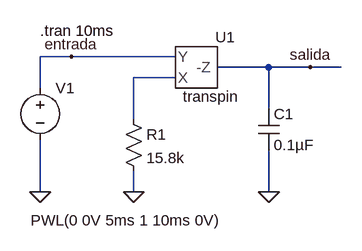
[diagram p0: schematic Integrador inversor.asc]
Integrador inversor.asc, the LTspice schematic file:
Version 4
SHEET 1 880 680
WIRE 96 144 48 144
WIRE 256 144 96 144
WIRE 400 160 320 160
WIRE 464 160 400 160
WIRE 512 160 464 160
WIRE 256 176 192 176
WIRE 48 192 48 144
WIRE 400 224 400 160
WIRE 192 240 192 176
WIRE 48 352 48 272
WIRE 192 352 192 320
WIRE 400 352 400 288
FLAG 48 352 0
FLAG 192 352 0
FLAG 400 352 0
FLAG 464 160 salida
FLAG 96 144 entrada
SYMBOL voltage 48 176 R0
WINDOW 3 -15 220 Left 0
WINDOW 123 0 0 Left 0
WINDOW 39 0 0 Left 0
SYMATTR InstName V1
SYMATTR Value PWL(0 0V 5ms 1 10ms 0V)
SYMBOL transpin 288 96 R0
SYMATTR InstName U1
SYMBOL res 176 224 R0
SYMATTR InstName R1
SYMATTR Value 15.8k
SYMBOL cap 384 224 R0
SYMATTR InstName C1
SYMATTR Value 0.1µF
TEXT 48 104 Left 0 !.tran 10ms

The netlist it stands for:
* Integrador inversor.asc
V1 entrada 0 PWL(0 0V 5ms 1 10ms 0V)
XU1 entrada N001 salida transpin  ; pins Y X Z
R1 N001 0 15.8k
C1 salida 0 0.1µF
.tran 10ms
.lib ..\sym\Circuitos2\ComponentesIdeales\compoideales.lib
.backanno
.end